# Altium schematic sheet 排线座直接复制即可.SchDoc
size A4
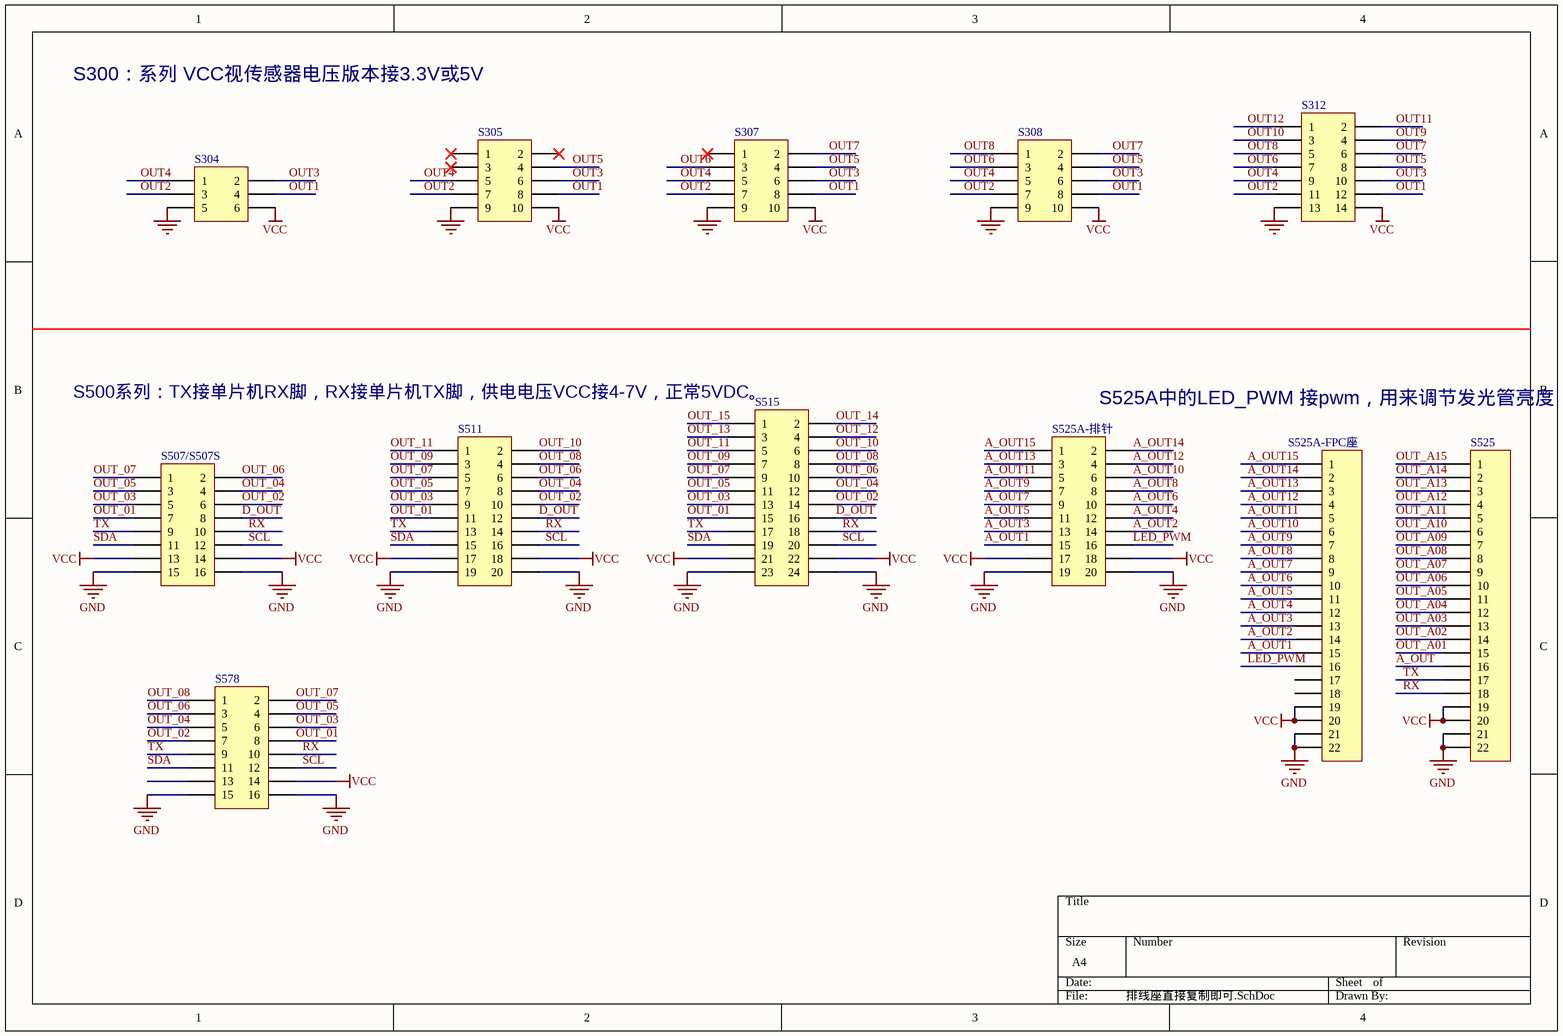
[diagram p0: 排线座直接复制即可.SchDoc]

## Parts
S304  Header 3x2  [DC3-6P]  (value not drawn)
S305  Header 5X2  [DC3-10P]  (value not drawn)
S307  Header 5X2  [DC3-10P]  (value not drawn)
S308  Header 5X2  [DC3-10P]  (value not drawn)
S312  Header 7X2  [DC3-14P]  (value not drawn)
S507/S507S  Header 8X2  [DC3-16P]  (value not drawn)
S511  Header 10X2  [DC3-20P]  (value not drawn)
S515  Header 12X2  [DC3-24P]  (value not drawn)
S525  Header 22  [FPC1.0-2H-WS-22P]  (value not drawn)
S525A-FPC座  Header 22  [FPC1.0-2H-WS-22P]  (value not drawn)
S525A-排针  (no value)  [DC3-MINI-20P]
S578  Header 8X2  [DC3-16P]  (value not drawn)

## Nets
GND: S304.5 S305.9 S307.9 S308.9 S312.13 S507/S507S.15 S507/S507S.16 S511.19 S511.20 S515.23 S515.24 S525.21 S525.22 S525A-FPC座.21 S525A-FPC座.22 S525A-排针.19 S525A-排针.20 S578.15 S578.16
VCC: S304.6 S305.10 S307.10 S308.10 S312.14 S507/S507S.13 S507/S507S.14 S511.17 S511.18 S515.21 S515.22 S525.19 S525.20 S525A-FPC座.19 S525A-FPC座.20 S525A-排针.17 S525A-排针.18 S578.14
A_OUT: S525.16
A_OUT1: S525A-FPC座.15 S525A-排针.15
A_OUT2: S525A-FPC座.14 S525A-排针.14
A_OUT3: S525A-FPC座.13 S525A-排针.13
A_OUT4: S525A-FPC座.12 S525A-排针.12
A_OUT5: S525A-FPC座.11 S525A-排针.11
A_OUT6: S525A-FPC座.10 S525A-排针.10
A_OUT7: S525A-FPC座.9 S525A-排针.9
A_OUT8: S525A-FPC座.8 S525A-排针.8
A_OUT9: S525A-FPC座.7 S525A-排针.7
A_OUT10: S525A-FPC座.6 S525A-排针.6
A_OUT11: S525A-FPC座.5 S525A-排针.5
A_OUT12: S525A-FPC座.4 S525A-排针.4
A_OUT13: S525A-FPC座.3 S525A-排针.3
A_OUT14: S525A-FPC座.2 S525A-排针.2
A_OUT15: S525A-FPC座.1 S525A-排针.1
D_OUT: S507/S507S.8 S511.12 S515.16
LED_PWM: S525A-FPC座.16 S525A-排针.16
OUT1: S304.4 S305.8 S307.8 S308.8 S312.12
OUT2: S304.3 S305.7 S307.7 S308.7 S312.11
OUT3: S304.2 S305.6 S307.6 S308.6 S312.10
OUT4: S304.1 S305.5 S307.5 S308.5 S312.9
OUT5: S305.4 S307.4 S308.4 S312.8
OUT6: S307.3 S308.3 S312.7
OUT7: S307.2 S308.2 S312.6
OUT8: S308.1 S312.5
OUT9: S312.4
OUT10: S312.3
OUT11: S312.2
OUT12: S312.1
OUT_01: S507/S507S.7 S511.11 S515.15 S578.8
OUT_02: S507/S507S.6 S511.10 S515.14 S578.7
OUT_03: S507/S507S.5 S511.9 S515.13 S578.6
OUT_04: S507/S507S.4 S511.8 S515.12 S578.5
OUT_05: S507/S507S.3 S511.7 S515.11 S578.4
OUT_06: S507/S507S.2 S511.6 S515.10 S578.3
OUT_07: S507/S507S.1 S511.5 S515.9 S578.2
OUT_08: S511.4 S515.8 S578.1
OUT_09: S511.3 S515.7
OUT_10: S511.2 S515.6
OUT_11: S511.1 S515.5
OUT_12: S515.4
OUT_13: S515.3
OUT_14: S515.2
OUT_15: S515.1
OUT_A01: S525.15
OUT_A02: S525.14
OUT_A03: S525.13
OUT_A04: S525.12
OUT_A05: S525.11
OUT_A06: S525.10
OUT_A07: S525.9
OUT_A08: S525.8
OUT_A09: S525.7
OUT_A10: S525.6
OUT_A11: S525.5
OUT_A12: S525.4
OUT_A13: S525.3
OUT_A14: S525.2
OUT_A15: S525.1
RX: S507/S507S.10 S511.14 S515.18 S525.18 S578.10
SCL: S507/S507S.12 S511.16 S515.20 S578.12
SDA: S507/S507S.11 S511.15 S515.19 S578.11
TX: S507/S507S.9 S511.13 S515.17 S525.17 S578.9

Not connected (* = marked no-connect by the designer): S305 1* 2* 3*; S307 1*; S525A-FPC座 17 18; S578 13

## Notes on the sheet
- S300：系列 VCC视传感器电压版本接3.3V或5V
- S500系列：TX接单片机RX脚，RX接单片机TX脚，供电电压VCC接4-7V，正常5VDC。
- S525A中的LED_PWM 接pwm，用来调节发光管亮度

## Library data of the parts
S304 = Header 3x2: Header, 3-Pin, Dual row; Revision: 17-Jul-2002: Re-released for DXP Platform.; Publisher: Altium Limited
S305 S307 S308 = Header 5X2: Header, 5-Pin, Dual row; Revision: 17-Jul-2002: Re-released for DXP Platform.; Publisher: Altium Limited
S312 = Header 7X2: Header, 7-Pin, Dual row; Revision: 17-Jul-2002: Re-released for DXP Platform.; Publisher: Altium Limited
S507/S507S S578 = Header 8X2: Header, 8-Pin, Dual row; Revision: 17-Jul-2002: Re-released for DXP Platform.; Publisher: Altium Limited
S511 S525A-排针 = Header 10X2: Header, 10-Pin, Dual row; Revision: 17-Jul-2002: Re-released for DXP Platform.; Publisher: Altium Limited
S515 = Header 12X2: Header, 12-Pin, Dual row; Revision: 17-Jul-2002: Re-released for DXP Platform.; Publisher: Altium Limited
S525 S525A-FPC座 = Header 22: Header, 22-Pin; Revision: 17-Jul-2002: Re-released for DXP Platform.; Publisher: Altium Limited